# Altium schematic sheet 15-M2_GNSS.SchDoc
size A3; SheetNumber: 14; SheetTotal: 15
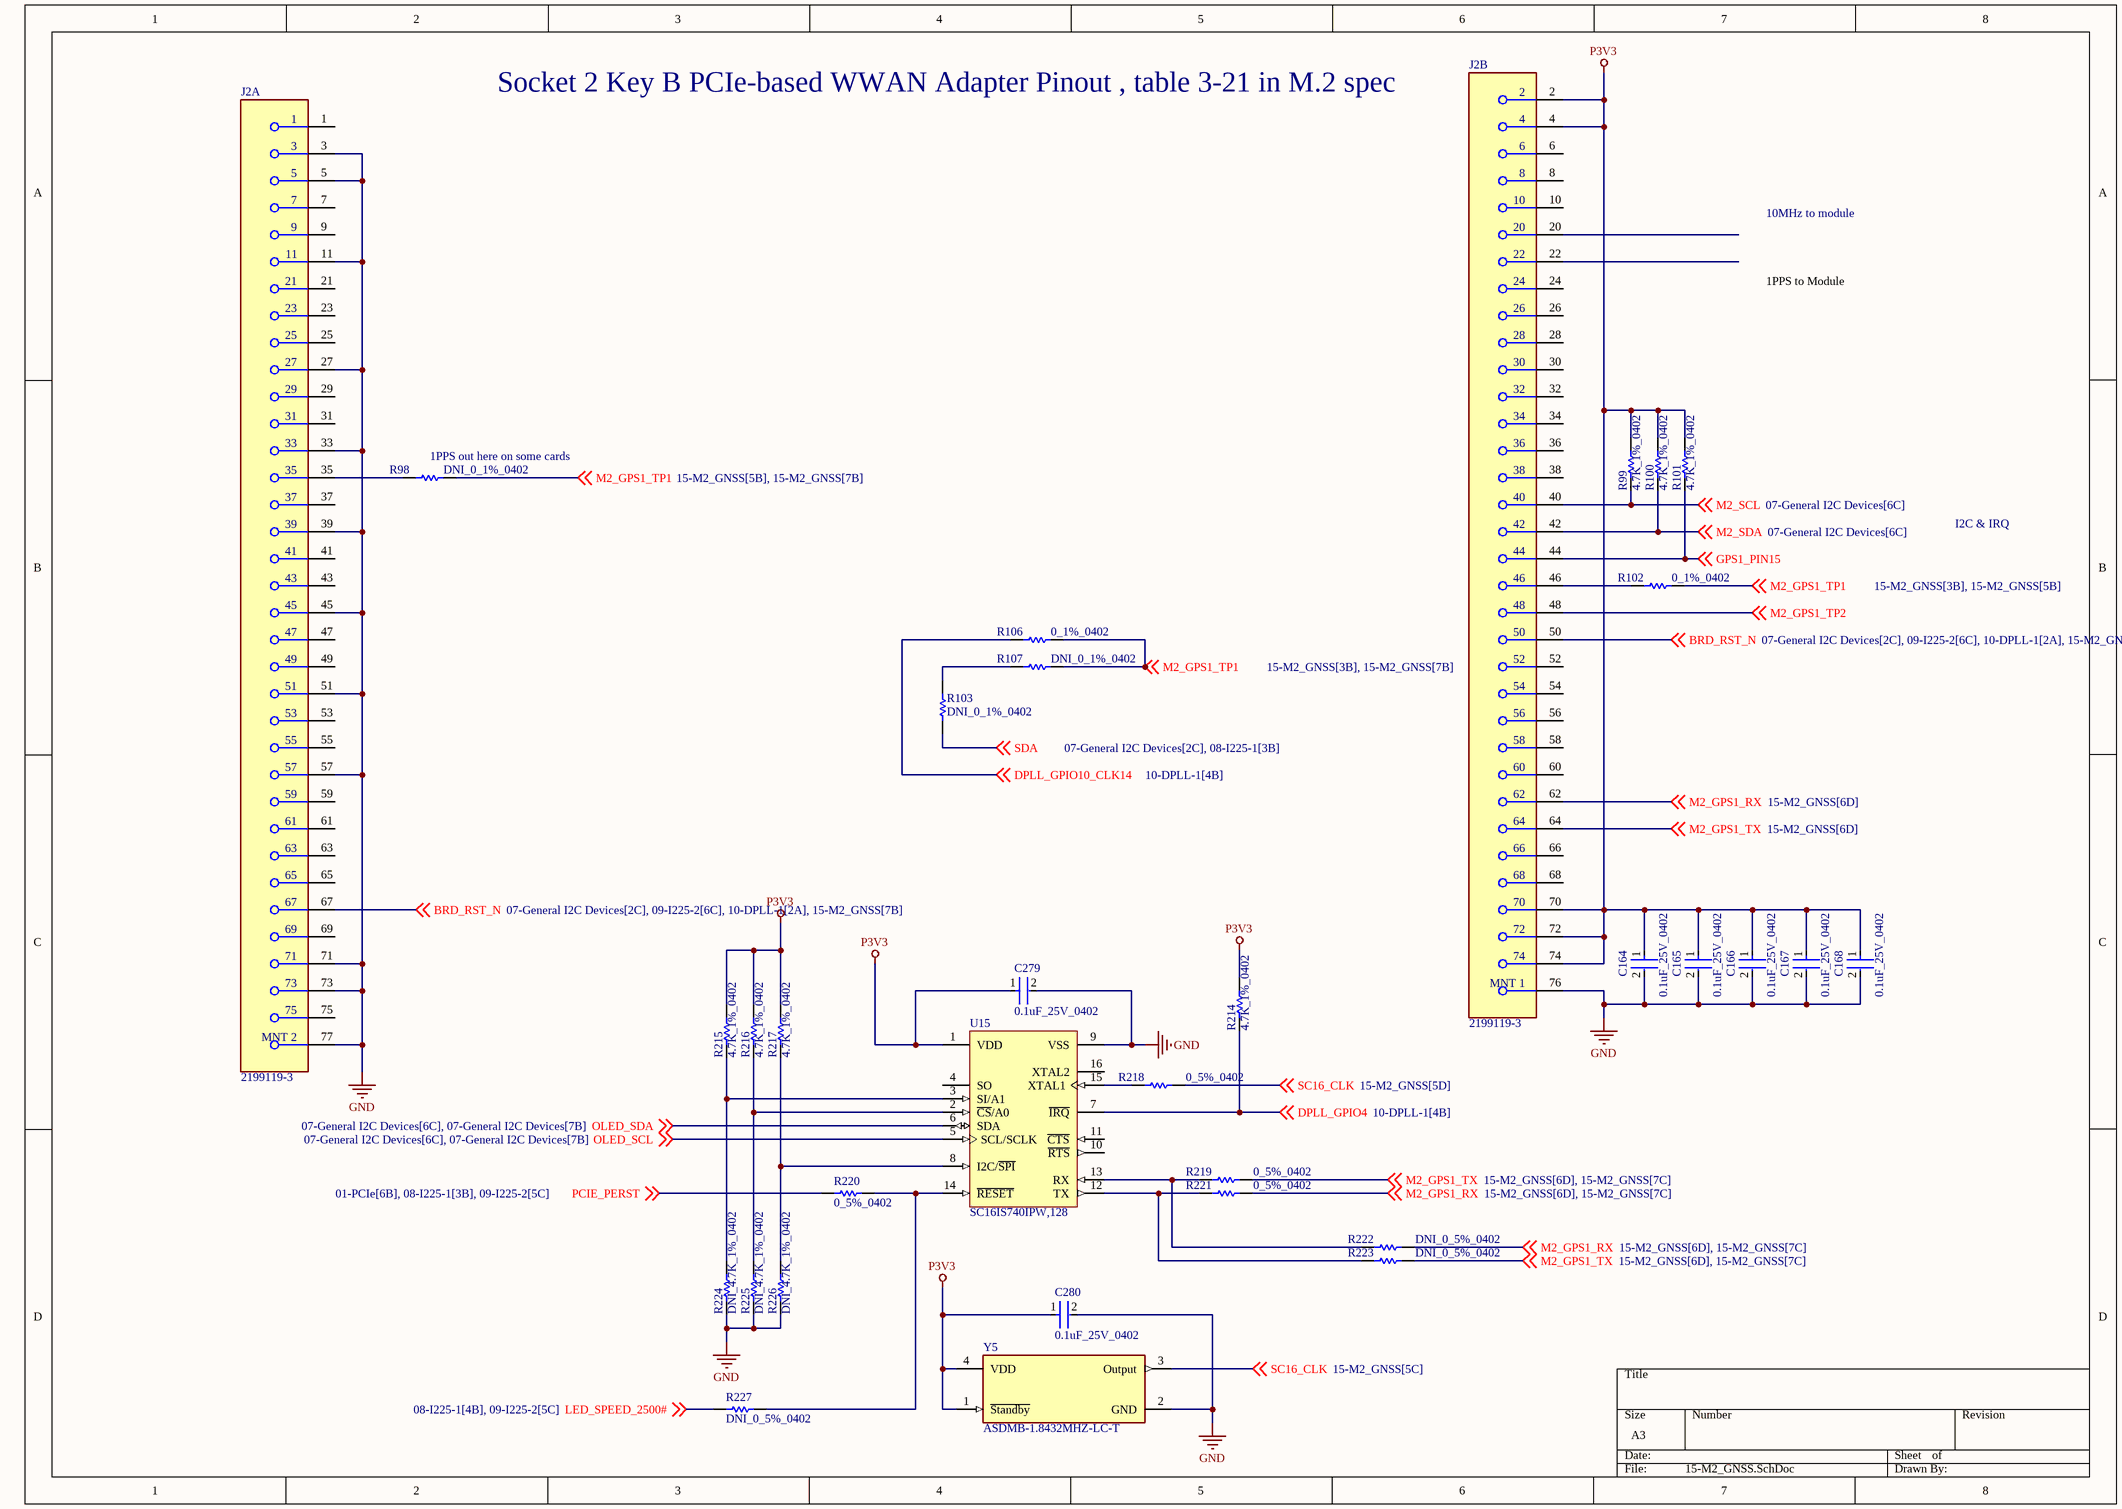
[diagram p0: 15-M2_GNSS.SchDoc]

## Parts
C164  0.1uF_25V_0402  [FP-0402-L_1_0_1-W_0_5_0_1-IPC_C]
C165  0.1uF_25V_0402  [FP-0402-L_1_0_1-W_0_5_0_1-IPC_C]
C166  0.1uF_25V_0402  [FP-0402-L_1_0_1-W_0_5_0_1-IPC_C]
C167  0.1uF_25V_0402  [FP-0402-L_1_0_1-W_0_5_0_1-IPC_C]
C168  0.1uF_25V_0402  [FP-0402-L_1_0_1-W_0_5_0_1-IPC_C]
C279  0.1uF_25V_0402  [FP-0402-L_1_0_1-W_0_5_0_1-IPC_C]
C280  0.1uF_25V_0402  [FP-0402-L_1_0_1-W_0_5_0_1-IPC_C]
J2  2199119-3  [FP-2199119-3-MFG]  (parts A,B of 2)
R98  DNI_0_1%_0402  [RESC1005X40X25LL05T05]  (no BOM)
R99  4.7K_1%_0402  [RESC1005X40X25NL10T10]
R100  4.7K_1%_0402  [RESC1005X40X25NL10T10]
R101  4.7K_1%_0402  [RESC1005X40X25NL10T10]
R102  0_1%_0402  [RESC1005X40X25LL05T05]
R103  DNI_0_1%_0402  [RESC1005X40X25LL05T05]  (no BOM)
R106  0_1%_0402  [RESC1005X40X25LL05T05]
R107  DNI_0_1%_0402  [RESC1005X40X25LL05T05]  (no BOM)
R214  4.7K_1%_0402  [RESC1005X40X25NL10T10]
R215  4.7K_1%_0402  [RESC1005X40X25NL10T10]
R216  4.7K_1%_0402  [RESC1005X40X25NL10T10]
R217  4.7K_1%_0402  [RESC1005X40X25NL10T10]
R218  0_5%_0402  [RESC1005X40X25LL10T10]
R219  0_5%_0402  [RESC1005X40X25LL10T10]
R220  0_5%_0402  [RESC1005X40X25LL10T10]
R221  0_5%_0402  [RESC1005X40X25LL10T10]
R222  DNI_0_5%_0402  [RESC1005X40X25LL10T10]  (no BOM)
R223  DNI_0_5%_0402  [RESC1005X40X25LL10T10]  (no BOM)
R224  DNI_4.7K_1%_0402  [RESC1005X40X25NL10T10]  (no BOM)
R225  DNI_4.7K_1%_0402  [RESC1005X40X25NL10T10]  (no BOM)
R226  DNI_4.7K_1%_0402  [RESC1005X40X25NL10T10]  (no BOM)
R227  DNI_0_5%_0402  [RESC1005X40X25LL10T10]  (no BOM)
U15  SC16IS740IPW,128  [NXP-SOT403-1_V]
Y5  ASDMB-1.8432MHZ-LC-T  [FP-ASDM-ASDMB-MFG]

## Nets
GND: C164.2 C165.2 C166.2 C167.2 C168.2 C279.2 C280.2 J2.3 J2.5 J2.11 J2.27 J2.33 J2.39 J2.45 J2.51 J2.57 J2.71 J2.73 J2.76(MNT_1) J2.77(MNT_2) R224.1 R225.1 R226.1 U15.9(VSS) Y5.2(GND)
P3V3: C164.1 C165.1 C166.1 C167.1 C168.1 C279.1 C280.1 J2.2 J2.4 J2.70 J2.72 J2.74 R99.2 R100.2 R101.2 R214.2 R215.2 R216.2 R217.2 U15.1(VDD) Y5.1(~{Standby}) Y5.4(VDD)
BRD_RST_N: J2.50 J2.67 ; off-sheet BRD_RST_N
DPLL_GPIO4: R214.1 U15.7(~{IRQ}) ; off-sheet DPLL_GPIO4
DPLL_GPIO10_CLK14: R106.1 ; off-sheet DPLL_GPIO10_CLK14
GPS1_PIN15: J2.44 R101.1 ; off-sheet GPS1_PIN15
LED_SPEED_2500#: R227.2 ; off-sheet LED_SPEED_2500#
M2_GPS1_RX: J2.62 R221.1 R222.1 ; off-sheet M2_GPS1_RX
M2_GPS1_TP1: R98.2 R102.2 R106.2 R107.2 ; off-sheet M2_GPS1_TP1
M2_GPS1_TP2: J2.48 ; off-sheet M2_GPS1_TP2
M2_GPS1_TX: J2.64 R219.1 R223.1 ; off-sheet M2_GPS1_TX
M2_SCL: J2.40 R99.1 ; off-sheet M2_SCL
M2_SDA: J2.42 R100.1 ; off-sheet M2_SDA
OLED_SCL: U15.5(SCL/SCLK) ; off-sheet OLED_SCL
OLED_SDA: U15.6(SDA) ; off-sheet OLED_SDA
PCIE_PERST: R220.2 ; off-sheet PCIE_PERST
SC16_CLK: R218.1 Y5.3(Output) ; off-sheet SC16_CLK
SDA: R103.1 ; off-sheet SDA
NetJ2_35: J2.35 R98.1
NetJ2_46: J2.46 R102.1
NetR103_2: R103.2 R107.1
NetR215_1: R215.1 R224.2 U15.3(SI/A1)
NetR216_1: R216.1 R225.2 U15.2(~{CS}/A0)
NetR217_1: R217.1 R226.2 U15.8(I2C/~{SPI})
NetR218_2: R218.2 U15.15(XTAL1)
NetR219_2: R219.2 R222.2 U15.13(RX)
NetR220_1: R220.1 R227.1 U15.14(~{RESET})
NetR221_2: R221.2 R223.2 U15.12(TX)

Not connected (* = marked no-connect by the designer): J2 1 6 7 8 9 10 20 21 22 23 24 25 26 28 29 30 31 32 34 36 37 38 41 43 47 49 52 53 54 55 56 58 59 60 61 63 65 66 68 69 75; U15 4(SO) 10(~{RTS}) 11(~{CTS}) 16(XTAL2)

## Notes on the sheet
- (near J2) Socket 2 Key B PCIe-based WWAN Adapter Pinout , table 3-21 in M.2 spec
- 10MHz to module
- 1PPS to Module
- (near R98) 1PPS out here on some cards
- I2C & IRQ

## Library data of the parts
C164-C168 C279 C280 = CMP-2008-02519-2: General Purpose Ceramic Capacitor, 0402, 100nF, 10%, X7R, 15%, 25V; Package Quantity: 1; Capacitance: 100nF; Min Operating Temperature: -55°C; Voltage: 25V; Voltage Rating: 25V; Construction: Flat; Max Operating Temperature: 125°C; Radiation Hardening: No; Depth: 0.5mm; Thickness: 0.022inch; Voltage Rating (DC): 25V; Number of Pins: 2; Lead Free: Lead Free; Series: -; REACH SVHC: No SVHC; Length: 1mm; Dielectric: X7R; RoHS Compliant: Yes; Mount: Surface Mount; Packaging: Tape and Reel; Case/Package: 0402; Case Code (Imperial): 0402; Termination: SMD/SMT; Width: 0.02inch; Case Code (Metric): 1005; Tolerance: 10%
J2 = CMP-03365-000004-1: CONN M.2 FEMALE 67POS 0.020 GOLD; Contact Current Rating: 500mA; Number of Contacts: 67; PCB Mounting Orientation: Right Angle; Pitch: 0.5mm; Voltage Rating: 50V; Insulation Resistance: 500MR; Row Spacing: 7.55mm; Orientation: Right Angle; Length: 0.862inch; Radiation Hardening: No; Mount: Surface Mount; Contact Plating: Gold; Contact Material: Copper Alloy; Width: 8.7mm; Number of Rows: 2; Color: Black; ELV: Compliant; Housing Color: Black; Number of Positions: 67; Housing Material: Thermoplastic; Gender: Female; Min Operating Temperature: -40°C; Max Operating Temperature: 80°C; RoHS Compliant: Yes; Package Quantity: 1200; Packaging: Tape and Reel; Height: 3.2mm; Termination: Solder; Insulation Material: Thermoplastic; Max Voltage Rating (AC): 50V; Current Rating: 500mA
R98 R102 R103 R106 R107 = CMP-2000-07451-1: Chip Resistor, 0 Ohm, 0.1 W, -55 to 155 degC, 0402 (1005 Metric), RoHS, Tape and Reel; Manufacturer: Panasonic; Voltage Rating (DC): 50V; Temperature Coefficient: 600ppm/��C; Max Power Dissipation: 100mW; Resistance: 0mOhm; Tolerance: 5%; Number of Terminations: 2; Mount: SurfaceMount; Height: 0.35mm; Packaging: TapeandReel; Contact Plating: Tin; Manufacturer URL: http://www.panasonic.com/; Composition: ThickFilm; Max Operating Temperature: 155degC; REACH SVHC: NoSVHC; Case/Package: 0402; Package Reference: 402; Depth: 0.5mm; Package Description: 2-Pin Surface Mount Device, Body 1 x 0.5 mm; Datasheet URL: https://industrial.panasonic.com/cdbs/www-data/pdf/RDA0000/AOA0000C301.pdf; RoHSCompliant: True; Case Code (Imperial): 0402; Military Standard: Not; Min Operating Temperature: -55degC; Power Rating: 100mW; Datasheet Version: 03/2015; Length: 1mm; Case Code (Metric): 1005; Termination: SMD/SMT; Mounting Technology: SurfaceMount; Voltage Rating: 50V; Width: 0.02inch; Package Quantity: 1; Lead Free: LeadFree; Radiation Hardening: No
R99-R101 R214-R217 R224-R226 = CMP-2002-05217-1: Manufacturer: Bourns; Part Number: CR0402-FX-4701GLF
R218-R223 R227 = CMP-2002-04569-1: Manufacturer: KOA Speer; Part Number: RK73Z1ETTP
U15 = CMP-1651-00006-1: Single UART with I2C-Bus/SPI Interface, 64 Bytes of Transmit and Receive FIFOs, IrDA SIR Built-in Support, 2.3 to 3.6 V, -40 to 95 degC, 16-Pin TSSOP (SOT403-1), RoHS, Tape and Reel; Data Rate: 5 Mbps; Supply Voltage Min: 2.3 V; Supply Current Max: 6 mA; Supply Voltage Max: 3.6 V; ComponentLink2Description: Datasheet; Generic Part Number: SC16IS740; ComponentLink3Description: Package Specification; ComponentLink1Description: Manufacturer URL; PackageDescription: 16-Pin Plastic Thin Shrink Small Outline Package, Body 5 x 4.4 mm, Pitch 0.65 mm; Mounting Technology: Surface Mount; Code_JEDEC: MO-153; DatasheetVersion: Rev. 7; Temperature Min: -40 degC; PartNumber: SC16IS740IPW,128; ComponentLink3URL: http://www.nxp.com/documents/outline_drawing/sot403-1_po.pdf; ComponentLink2URL: http://cache.nxp.com/documents/data_sheet/SC16IS740_750_760.pdf?pspll=1; Packing: Tape and Reel; ComponentLink1URL: http://www.nxp.com/; Temperature Max: 95 degC; RoHS: TRUE; PackageVersion: 03-02-18, 02/2003
Y5 = CMP-27762-001563-1: MEMS Oscillator 1.8432MHz ±50ppm LVCMOS 1.8V~3.3V SMD 2.5x2mm; Operating Supply Voltage: 3.3V; Load Capacitance: 15pF; Max Supply Voltage: 4V; Min Supply Voltage: -300mV; Max Supply Current: 16mA; Frequency Stability: 50ppm; Frequency: 1.8432MHz; Height: 0.035inch; Mount: Surface Mount; Max Operating Temperature: 85°C; RoHS Compliant: Yes; Min Operating Temperature: -40°C; Packaging: Tape and Reel; Number of Pins: 4; Length: 0.098inch; Width: 0.079inch; Case/Package: SMD/SMT; Series: Pure Silicon™ ASDMB; Termination: SMD/SMT